# EAGLE design untitled (EAGLE 8.4.0)
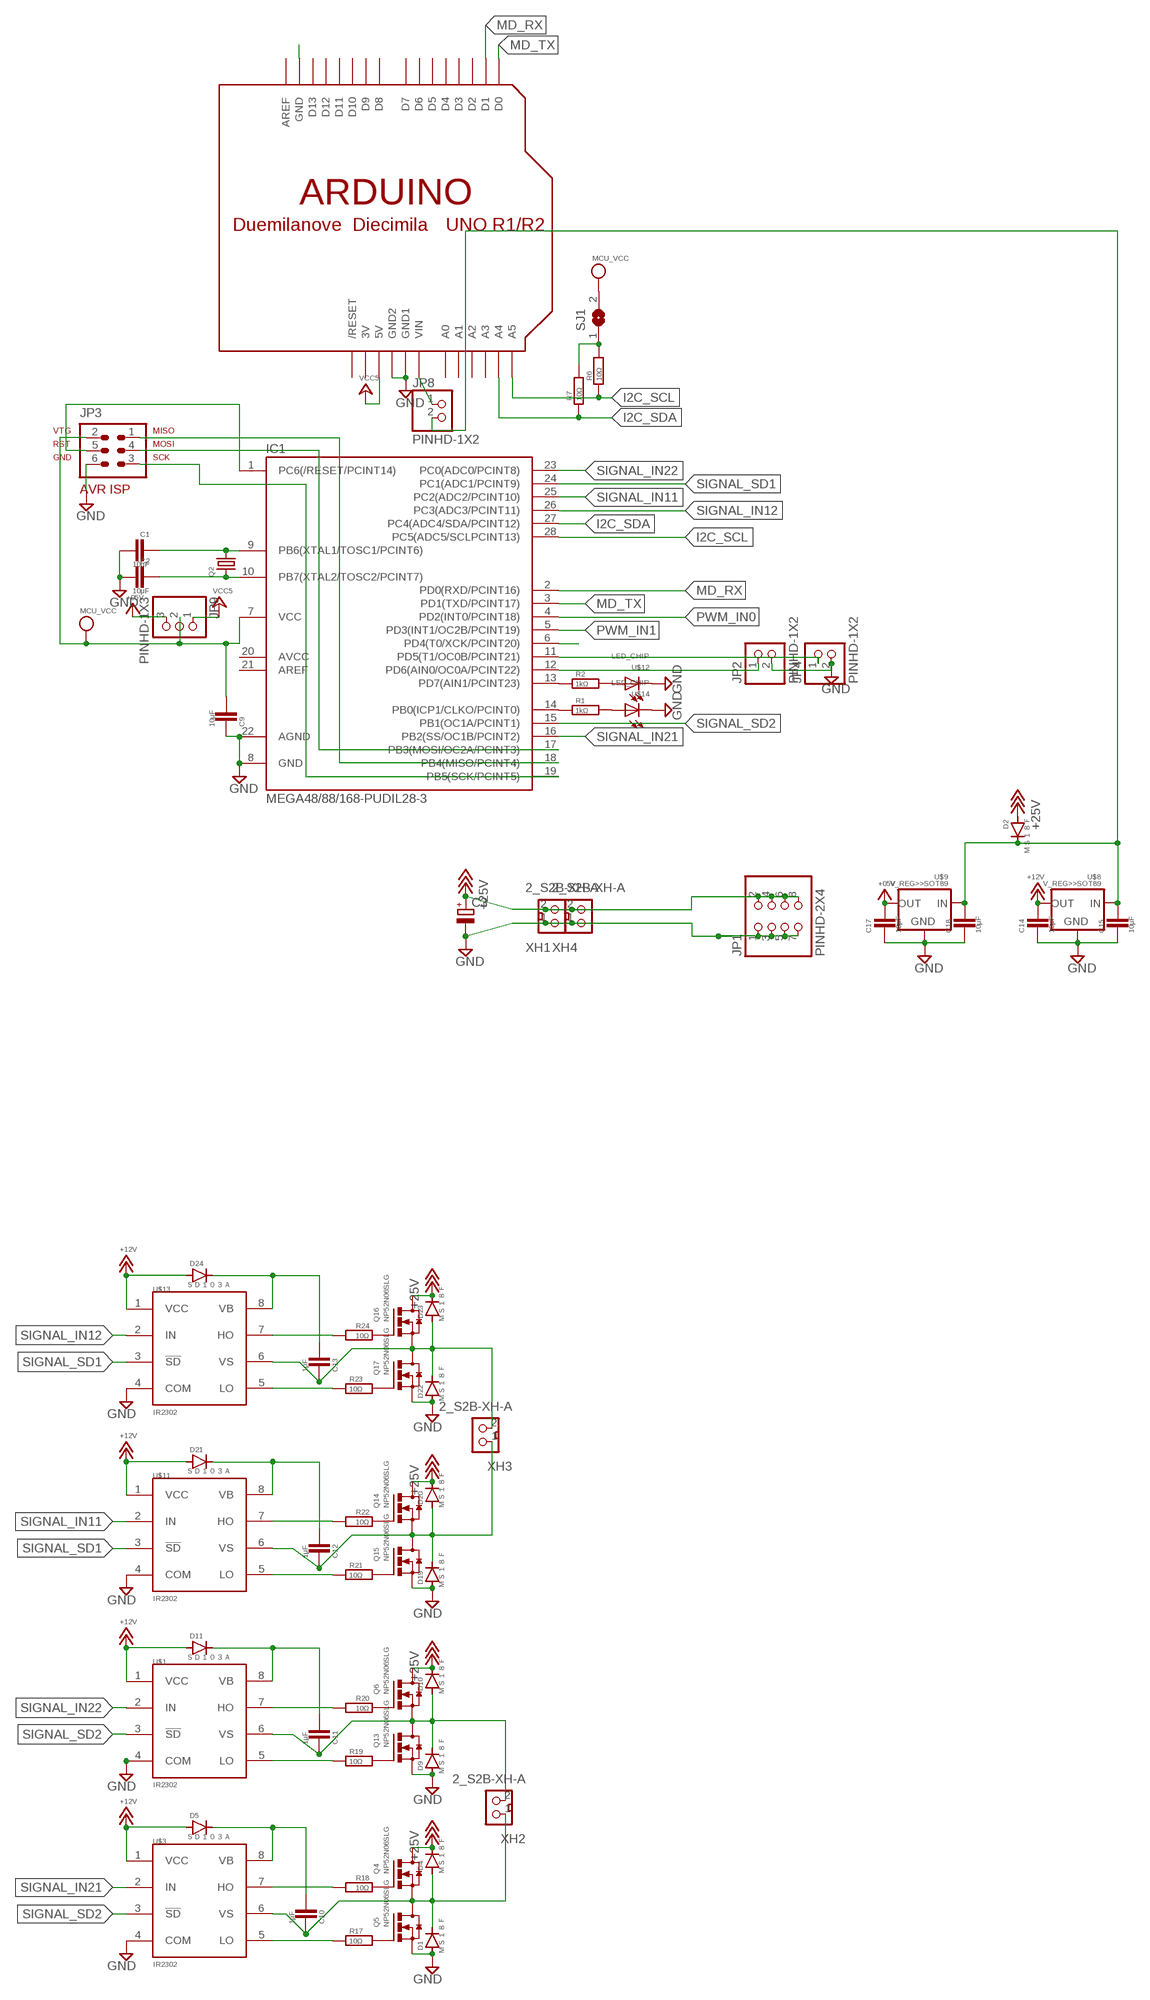
[diagram p0: schematic, sheet 1]

## Parts
C1  10μF  CAPACITOR>>2012  [2012]
C2  10μF  CAPACITOR>>2012  [2012]
C3  CPOL-EUUD-6,3X8,8  [UD-6,3X5,8_NICHICON]
C9  10μF  CAPACITOR>>2012  [2012]
C10  1μF  CAPACITOR>>2012  [2012]
C11  1μF  CAPACITOR>>2012  [2012]
C12  1μF  CAPACITOR>>2012  [2012]
C13  1μF  CAPACITOR>>2012  [2012]
C14  10μF  CAPACITOR>>2012  [2012]
C15  10μF  CAPACITOR>>2012  [2012]
C17  10μF  CAPACITOR>>2012  [2012]
C18  10μF  CAPACITOR>>2012  [2012]
D1  ＭＳ１８Ｆ  DIODE>>MS18F  [MS18F]
D2  ＭＳ１８Ｆ  DIODE>>MS18F  [MS18F]
D4  ＭＳ１８Ｆ  DIODE>>MS18F  [MS18F]
D5  ＳＤ１０３Ａ  DIODE>>SOD123  [SOD123]
D9  ＭＳ１８Ｆ  DIODE>>MS18F  [MS18F]
D10  ＭＳ１８Ｆ  DIODE>>MS18F  [MS18F]
D11  ＳＤ１０３Ａ  DIODE>>SOD123  [SOD123]
D19  ＭＳ１８Ｆ  DIODE>>MS18F  [MS18F]
D20  ＭＳ１８Ｆ  DIODE>>MS18F  [MS18F]
D21  ＳＤ１０３Ａ  DIODE>>SOD123  [SOD123]
D22  ＭＳ１８Ｆ  DIODE>>MS18F  [MS18F]
D23  ＭＳ１８Ｆ  DIODE>>MS18F  [MS18F]
D24  ＳＤ１０３Ａ  DIODE>>SOD123  [SOD123]
IC1  MEGA48/88/168-PUDIL28-3  [DIL28-3]
JP1  PINHD-2X4  [2X04]
JP2  PINHD-1X2  [1X02]
JP3  AVR-ISP-6  [AVR-ISP-6]
JP4  PINHD-1X2  [1X02]
JP8  PINHD-1X2  [1X02]
JP9  PINHD-1X3  [1X03]
Q2  CRYSTALHC49S  [HC49/S]
Q4  NP52N06SLG  MOSFET_N>>TO252  [TO252]
Q5  NP52N06SLG  MOSFET_N>>TO252  [TO252]
Q6  NP52N06SLG  MOSFET_N>>TO252  [TO252]
Q13  NP52N06SLG  MOSFET_N>>TO252  [TO252]
Q14  NP52N06SLG  MOSFET_N>>TO252  [TO252]
Q15  NP52N06SLG  MOSFET_N>>TO252  [TO252]
Q16  NP52N06SLG  MOSFET_N>>TO252  [TO252]
Q17  NP52N06SLG  MOSFET_N>>TO252  [TO252]
R1  1kΩ  REGISTER>>2012  [2012]
R2  1kΩ  REGISTER>>2012  [2012]
R6  10Ω  REGISTER>>2012  [2012]
R7  10Ω  REGISTER>>2012  [2012]
R17  10Ω  REGISTER>>2012  [2012]
R18  10Ω  REGISTER>>2012  [2012]
R19  10Ω  REGISTER>>2012  [2012]
R20  10Ω  REGISTER>>2012  [2012]
R21  10Ω  REGISTER>>2012  [2012]
R22  10Ω  REGISTER>>2012  [2012]
R23  10Ω  REGISTER>>2012  [2012]
R24  10Ω  REGISTER>>2012  [2012]
SJ1  SJ  [SJ]
U$1  IR2302  IR2302IR2302  [DIL08]
U$2  ARDUINO-NOHOLE  [ARDUINO-NOHOLE]
U$3  IR2302  IR2302IR2302  [DIL08]
U$8  V_REG>>SOT89  [SOT89]
U$9  V_REG>>SOT89  [SOT89]
U$11  IR2302  IR2302IR2302  [DIL08]
U$12  LED_CHIP  [2012]
U$13  IR2302  IR2302IR2302  [DIL08]
U$14  LED_CHIP  [2012]
XH1  2_S2B-XH-A  [S2B-XH-A]
XH2  2_S2B-XH-A  [S2B-XH-A]
XH3  2_S2B-XH-A  [S2B-XH-A]
XH4  2_S2B-XH-A  [S2B-XH-A]

## Nets
+5V: C17.1 JP9.3 U$9.1(OUT) ; supply symbol labelled +05V
+12V: C14.1 D5.A D11.A D21.A D24.A U$1.1(VCC) U$3.1(VCC) U$8.1(OUT) U$11.1(VCC) U$13.1(VCC)
+18V: C3.+ D2.P$1(A) D4.P$2(C) D10.P$2(C) D20.P$2(C) D23.P$2(C) JP1.2 JP1.4 JP1.6 JP1.8 Q4.3(D) Q6.3(D) Q14.3(D) Q16.3(D) XH1.2 XH4.2 ; supply symbol labelled +25V
GND: C1.1 C2.1 C3.- C9.2 C14.2 C15.2 C17.2 C18.2 D1.P$1(A) D9.P$1(A) D19.P$1(A) D22.P$1(A) IC1.8(GND) IC1.22(AGND) JP1.1 JP1.3 JP1.5 JP1.7 JP2.2 JP3.6 JP4.2 Q5.2(S) Q13.2(S) Q15.2(S) Q17.2(S) U$1.4(COM) U$2.GND1 U$2.GND2 U$3.4(COM) U$8.2(GND) U$8.2.1(GND) U$9.2(GND) U$9.2.1(GND) U$11.4(COM) U$12.P$2(C) U$13.4(COM) U$14.P$2(C) XH1.1 XH4.1
I2C_SCL: IC1.28(PC5(ADC5/SCLPCINT13)) R6.1 U$2.A5
I2C_SDA: IC1.27(PC4(ADC4/SDA/PCINT12)) R7.1 U$2.A4
MD_RX: IC1.2(PD0(RXD/PCINT16)) U$2.D1
MD_TX: IC1.3(PD1(TXD/PCINT17)) U$2.D0
N$1: C15.1 C18.1 D2.P$2(C) JP8.2 U$8.3(IN) U$9.3(IN)
N$2: JP8.1 U$2.VIN
N$3: C13.2 D22.P$2(C) D23.P$1(A) Q16.2(S) Q17.3(D) U$13.6(VS) XH3.2
N$4: IC1.14(PB0(ICP1/CLKO/PCINT0)) R1.1
N$5: IC1.1(PC6(/RESET/PCINT14)) JP3.5
N$6: IC1.12(PD6(AIN0/OC0A/PCINT22)) JP2.1
N$7: C1.2 IC1.9(PB6(XTAL1/TOSC1/PCINT6)) Q2.2
N$8: C2.2 IC1.10(PB7(XTAL2/TOSC2/PCINT7)) Q2.1
N$9: IC1.11(PD5(T1/OC0B/PCINT21)) JP4.1
N$10: IC1.13(PD7(AIN1/PCINT23)) R2.1
N$11: IC1.19(PB5(SCK/PCINT5)) JP3.3
N$12: C11.2 D9.P$2(C) D10.P$1(A) Q6.2(S) Q13.3(D) U$1.6(VS) XH2.2
N$14: IC1.6(PD4(T0/XCK/PCINT20))
N$15: R1.2 U$14.P$1(A)
N$16: R2.2 U$12.P$1(A)
N$17: C10.2 D1.P$2(C) D4.P$1(A) Q4.2(S) Q5.3(D) U$3.6(VS) XH2.1
N$18: Q5.1(G) R17.2
N$19: R17.1 U$3.5(LO)
N$20: R6.2 R7.2 SJ1.1
N$21: IC1.17(PB3(MOSI/OC2A/PCINT3)) JP3.4
N$22: IC1.18(PB4(MISO/PCINT4)) JP3.1
N$23: R18.2 U$3.7(HO)
N$24: C10.1 D5.C U$3.8(VB)
N$25: Q4.1(G) R18.1
N$27: U$2.GND
N$32: Q13.1(G) R19.2
N$34: R19.1 U$1.5(LO)
N$42: R20.2 U$1.7(HO)
N$45: C11.1 D11.C U$1.8(VB)
N$46: Q6.1(G) R20.1
N$48: C12.2 D19.P$2(C) D20.P$1(A) Q14.2(S) Q15.3(D) U$11.6(VS) XH3.1
N$50: Q15.1(G) R21.2
N$51: R21.1 U$11.5(LO)
N$52: R22.2 U$11.7(HO)
N$53: C12.1 D21.C U$11.8(VB)
N$54: Q14.1(G) R22.1
N$56: Q17.1(G) R23.2
N$57: R23.1 U$13.5(LO)
N$58: R24.2 U$13.7(HO)
N$59: C13.1 D24.C U$13.8(VB)
N$60: Q16.1(G) R24.1
PWM_IN0: IC1.4(PD2(INT0/PCINT18))
PWM_IN1: IC1.5(PD3(INT1/OC2B/PCINT19))
SIGNAL_IN11: IC1.25(PC2(ADC2/PCINT10)) U$11.2(IN)
SIGNAL_IN12: IC1.26(PC3(ADC3/PCINT11)) U$13.2(IN)
SIGNAL_IN21: IC1.16(PB2(SS/OC1B/PCINT2)) U$3.2(IN)
SIGNAL_IN22: IC1.23(PC0(ADC0/PCINT8)) U$1.2(IN)
SIGNAL_SD1: IC1.24(PC1(ADC1/PCINT9)) U$11.3(!SD) U$13.3(!SD)
SIGNAL_SD2: IC1.15(PB1(OC1A/PCINT1)) U$1.3(!SD) U$3.3(!SD)
VCC: C9.1 IC1.7(VCC) JP3.2 JP9.2 SJ1.2 ; supply symbol labelled MCU_VCC
VCC5: JP9.1 U$2.5V
Unconnected: IC1.20(AVCC) IC1.21(AREF) U$2.A0 U$2.A1 U$2.A2 U$2.A3 U$2.AREF U$2.D2 U$2.D3 U$2.D4 U$2.D5 U$2.D6 U$2.D7 U$2.D8 U$2.D9 U$2.D10 U$2.D11 U$2.D12 U$2.D13 U$2.RESET(/RESET)

## Power pins joined to a net without a drawn wire
3V: U$2.3V

## Library data of the parts
C1 C2 C9-C15 C17 C18 = !SMD:CAPACITOR>>
C3 = !rcl:CPOL-EU: POLARIZED CAPACITOR, European symbol
D1 D2 D4 D5 D9-D11 D19-D24 = !diode:DIODE>>: DIODE
IC1 = !avr:MEGA48/88/168-PU
JP1 = !pinhead(ﾋﾟﾝﾍｯﾀﾞ):PINHD-2X4: PIN HEADER
JP2 JP4 JP8 = !pinhead(ﾋﾟﾝﾍｯﾀﾞ):PINHD-1X2: PIN HEADER
JP3 = !avr:AVR-ISP-6: AVR ISP-6 Serial Programming Header
JP9 = !pinhead(ﾋﾟﾝﾍｯﾀﾞ):PINHD-1X3: PIN HEADER
Q2 = !crystal(水晶):CRYSTAL: CRYSTAL; OC_FARNELL: 1667008; OC_NEWARK: unknown
Q4-Q6 Q13-Q17 = !FET_transister_v-reg:MOSFET_N>>
R1 R2 R6 R7 R17-R24 = !SMD:REGISTER>>
SJ1 = jumper:SJ: SMD solder JUMPER
U$1 U$3 U$11 U$13 = !irs(GateDriver):IR2302
U$2 = adafruit:ARDUINO: Arduino Diecimila/Duemilanove Make a shield with ease, this package has all the named pins as well as the two mounting drill holes and an outline of the USB and DC power connector. The outline is on the DIMENSION layer, so if your board house uses it they will cut the outline to match. http://www.ladyada.net/library/pcb/eaglelibrary.html
U$8 U$9 = !FET_transister_v-reg:V_REG>>
U$12 U$14 = !led:LED_CHIP
XH1-XH4 = !con-xh:2_: Wire-to-Board 2.5mm pitch top mount connector Source: http://www.jst-mfg.com/product/pdf/jpn/XH.pdf http://www.jst-mfg.com/product/detail.php?series=277

## Board
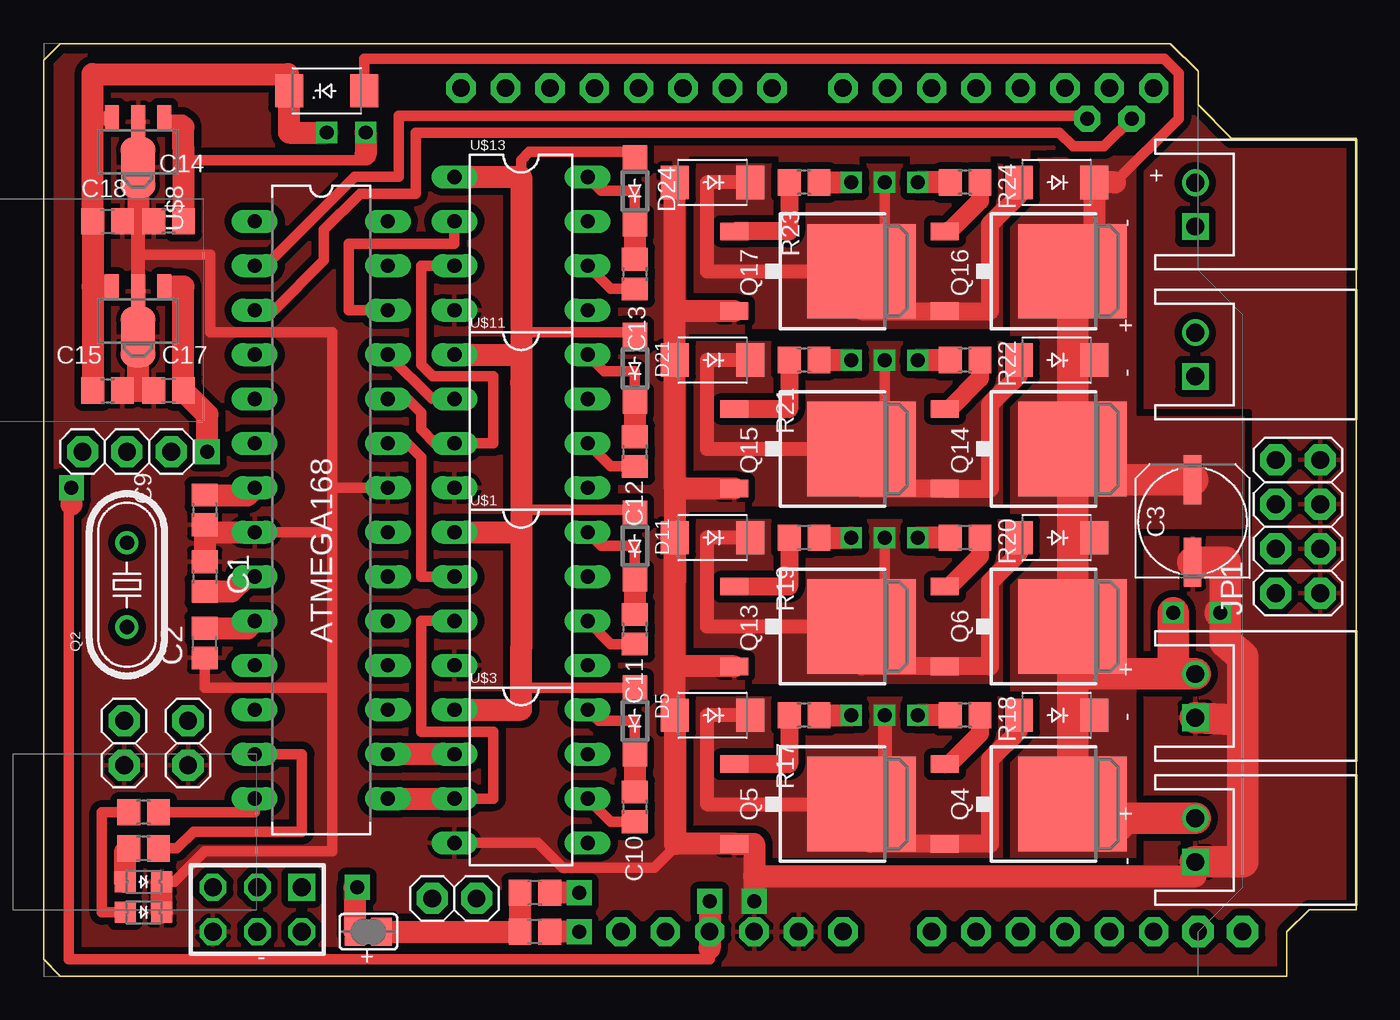
[diagram p1: board, top side]
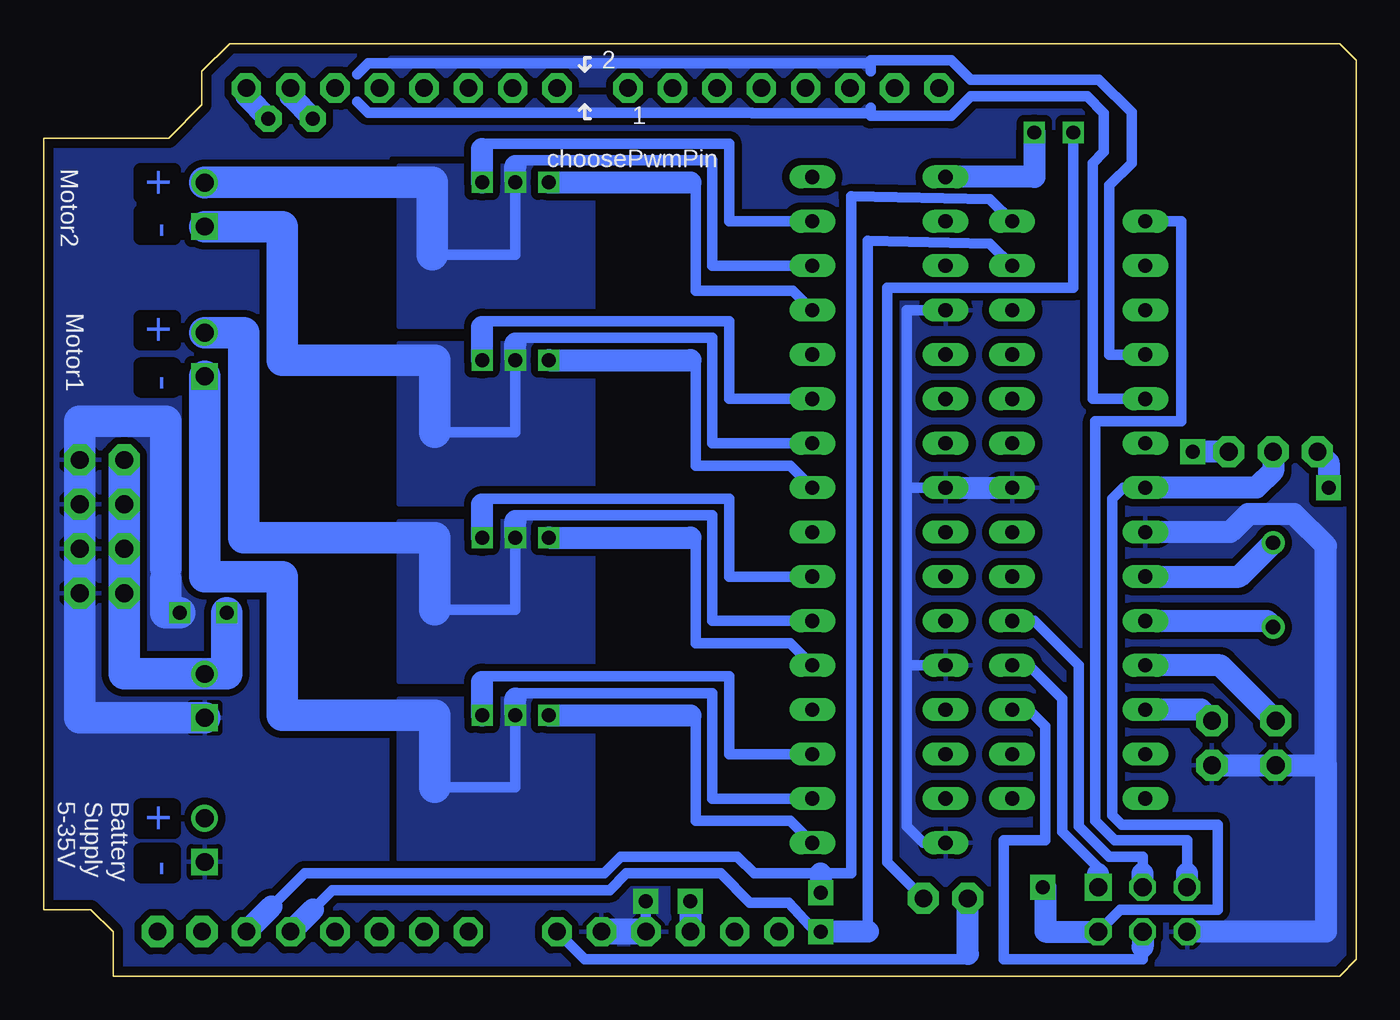
[diagram p2: board, bottom side, seen from below]

Size 75.09 x 53.34 mm. Coordinates in mm from the lower left corner, seen from the top.
Outline: 0.95,53.34 0,52.39 0,0.95 0.95,0 71.12,0 71.12,2.54 72.39,3.81 75.09,3.81 75.09,47.94 67.94,47.94 66.04,49.85 66.04,51.75 64.45,53.34 0.95,53.34
Copper layers (1*16): Top 0.035mm / dielectric 1.5mm / Bottom 0.035mm
Design rules "yumeko *": minimum track width 6mil, minimum drill 0.35mm, track to track 8mil, track to pad 8mil, pad to pad 8mil, via to via 8mil, smd to smd 8mil, copper to edge 20mil, drill to drill 8mil, minimum pad ring 10mil, minimum via ring 8mil, stop-mask expansion 4mil, vias tented up to drill 0mil, thermal gap 10mil

### Footprints (pad centres in the part's own frame; a part is rotated, then mirrored left to right if it is on the bottom)
2012 = smd 1.3 x 1.5: 1 -0.85,0; 2 0.85,0
UD-6,3X5,8_NICHICON = smd 2.8 x 1: + 2.35,0; - -2.35,0
MS18F = smd 1.6 x 1.9: P$1 -2.15,0; P$2 2.15,0
SOD123 = smd 1.4 x 1.4: A 1.9,0; C -1.9,0
DIL28-3 = drill 0.813 long: 1 -16.51,-3.81; 2 -13.97,-3.81; 3 -11.43,-3.81; 4 -8.89,-3.81; 5 -6.35,-3.81; 6 -3.81,-3.81; 7 -1.27,-3.81; 8 1.27,-3.81; 9 3.81,-3.81; 10 6.35,-3.81; 11 8.89,-3.81; 12 11.43,-3.81; 13 13.97,-3.81; 14 16.51,-3.81; 15 16.51,3.81; 16 13.97,3.81; 17 11.43,3.81; 18 8.89,3.81; 19 6.35,3.81; 20 3.81,3.81; 21 1.27,3.81; 22 -1.27,3.81; 23 -3.81,3.81; 24 -6.35,3.81; 25 -8.89,3.81; 26 -11.43,3.81; 27 -13.97,3.81; 28 -16.51,3.81
2X04 = drill 1.016 pad 1.778 octagon: 1 -3.81,-1.27; 2 -3.81,1.27; 3 -1.27,-1.27; 4 -1.27,1.27; 5 1.27,-1.27; 6 1.27,1.27; 7 3.81,-1.27; 8 3.81,1.27
1X02 = drill 1.016 pad 1.778 octagon: 1 -1.27,0; 2 1.27,0
AVR-ISP-6 = drill 1.016 square: 1 -2.54,-1.27 | drill 1.016 octagon: 2 -2.54,1.27; 3 0,-1.27; 4 0,1.27; 5 2.54,-1.27; 6 2.54,1.27
1X03 = drill 1.016 pad 1.778 octagon: 1 -2.54,0; 2 0,0; 3 2.54,0
HC49/S = drill 0.813: 1 -2.413,0; 2 2.413,0
TO252 = smd 1 x 1.6: 1 -2.28,-4.8; 2 2.28,-4.8 | smd 5.4 x 6.2: 3 0,2.5
SJ = smd 1.168 x 1.6: 1 -0.762,0; 2 0.762,0
DIL08 = drill 0.813 long: 1 -3.81,-3.81; 2 -1.27,-3.81; 3 1.27,-3.81; 4 3.81,-3.81; 5 3.81,3.81; 6 1.27,3.81; 7 -1.27,3.81; 8 -3.81,3.81
ARDUINO-NOHOLE = drill 1 pad 1.676 octagon: 3V 35.56,2.54; 5V 38.1,2.54; A0 50.8,2.54; A1 53.34,2.54; A2 55.88,2.54; A3 58.42,2.54; A4 60.96,2.54; A5 63.5,2.54; AREF 23.876,50.8; D0 63.5,50.8; D1 60.96,50.8; D2 58.42,50.8; D3 55.88,50.8; D4 53.34,50.8; D5 50.8,50.8; D6 48.26,50.8; D7 45.72,50.8; D8 41.656,50.8; D9 39.116,50.8; D10 36.576,50.8; D11 34.036,50.8; D12 31.496,50.8; D13 28.956,50.8; GND 26.416,50.8; GND1 43.18,2.54; GND2 40.64,2.54; RESET 33.02,2.54; VIN 45.72,2.54
SOT89 = smd 0.8 x 1.4: 1 -1.499,-1.981; 3 1.499,-1.981 | smd 0.8 x 1.9: 2 0,-1.727 | smd 2 x 3.5: 2.1 0,0.889
2012' = smd 1.2 x 1.2: P$1 -1.05,0; P$2 1.05,0
S2B-XH-A = drill 1.016 square: 1 1.25,0 | drill 1.016: 2 -1.25,0

### Placement (x,y rotation side)
C1  9.21,22.86 270 top
C2  9.21,19.05 90 top
C3  65.72,26.04 90 top
C9  9.21,26.67 270 top
C10  33.81,9.68 270 top
C11  33.81,19.84 270 top
C12  33.81,30 270 top
C13  33.81,40.16 270 top
C14  7.14,43.18 180 top
C15  3.65,33.5 0 top
C17  7.14,33.5 180 top
C18  3.65,43.18 0 top
D1  38.26,14.92 0 top
D2  16.19,50.64 180 top
D4  57.94,14.92 0 top
D5  33.81,14.61 90 top
D9  38.26,25.08 0 top
D10  57.94,25.08 0 top
D11  33.81,24.61 90 top
D19  38.26,35.24 0 top
D20  57.94,35.24 0 top
D21  33.81,34.77 90 top
D22  38.26,45.4 0 top
D23  57.94,45.4 0 top
D24  33.81,44.93 90 top
IC1  15.88,26.67 270 top
JP1  71.75,25.72 90 top
JP2  8.26,13.34 270 top
JP3  12.22,3.81 180 top
JP4  4.6,13.34 270 top
JP8  23.5,4.45 0 top
JP9  4.76,30 0 top
Q2  4.76,22.38 90 top
Q4  56.36,9.84 270 top
Q5  44.29,9.84 270 top
Q6  56.36,20 270 top
Q13  44.29,20 270 top
Q14  56.36,30.16 270 top
Q15  44.29,30.16 270 top
Q16  56.36,40.32 270 top
Q17  44.29,40.32 270 top
R1  5.71,9.37 180 top
R2  5.71,7.3 180 top
R6  28.1,4.76 180 top
R7  28.1,2.54 180 top
R17  43.5,14.92 180 top
R18  52.7,14.92 180 top
R19  43.5,25.08 180 top
R20  52.7,25.08 180 top
R21  43.5,35.24 180 top
R22  52.7,35.24 180 top
R23  43.5,45.4 180 top
R24  52.7,45.4 180 top
SJ1  18.57,2.54 180 top
U$1  27.3,21.59 270 top
U$2  0,0 0 top
U$3  27.3,11.43 270 top
U$8  5.4,47.15 180 top
U$9  5.4,37.47 180 top
U$11  27.3,31.75 270 top
U$12  LED_CHIP  [2012']  5.71,5.4 0 top
U$13  27.3,41.91 270 top
U$14  LED_CHIP  [2012']  5.71,3.65 0 top
XH1  65.88,16.03 270 top
XH2  65.88,35.56 270 top
XH3  65.88,44.13 270 top
XH4  65.88,7.78 270 top

### Tracks (layer width: path | path; a pad name or v marks a point on that pad's centre or on a via)
+5V  (via drill 0.8 pad 1.42)
  Top 0.813: 7.38,39.45 U$9.1
  Top 1.27: 7.38,39.45 7.99,39.45 C17.1 9.37,32.12 v9.37,30
  Bottom 1.27: JP9.3 v9.37,30
+12V  (via drill 0.8)
  Top 0.61: 27.3,33.97 27.3,26.67 | 27.3,18.73 27.3,16.51 | D24.A 33.81,47.15 27.78,47.15 27.3,46.67 27.3,45.72 27.3,36.83 | 27.3,35.56 27.3,36.83 | D5.A 27.3,16.51 | D11.A 33.81,26.67 27.3,26.67 | D21.A 33.81,36.83 27.3,36.83 | 27.3,26.67 27.3,25.4 | U$3.1 26.67,15.24 27.3,15.88 27.3,16.51 | 7.99,47.47 7.99,47.31 | 18.41,46.99 18.41,46.67 7.99,46.67
  Top 0.813: U$8.1 6.9,48.9 7.94,48.9 7.99,48.84 7.99,48.58
  Top 1.27: 7.99,48.58 7.99,47.31 7.99,46.67 C14.1 | U$1.1 27.3,25.4 | 27.3,25.4 27.3,18.73 27.3,15.24 U$3.1 | U$11.1 27.3,35.56 | 27.3,35.56 27.3,33.97 27.3,25.4 | U$13.1 27.3,45.72 27.3,35.56 | v18.41,48.26 18.41,46.99
  Bottom 1.27: U$13.1 18.41,45.72 v18.41,48.26
+18V  (via drill 0.8)
  Top 0.61: Q6.3 58.9,20 | Q4.3 58.9,9.84 | Q14.3 58.9,30.16 | Q16.3 57.63,40.32 | 18.51,50.64 D2.P$1 18.34,52.48 64.09,52.48 64.93,51.64 64.93,49.05 61.28,45.4
  Top 1.016: Q4.3 59.67,9.03 61.44,9.03
  Top 1.27: 60.13,40.32 Q16.3 59.49,40.62 | 60.17,40.32 60.13,40.32 | 59.53,9.84 58.86,9.91 58.86,14.92 D4.P$2 | 60.13,40.32 D23.P$2 61.28,45.4 | D20.P$2 58.86,35.24 | 58.86,25.08 D10.P$2
  Top 1.8: Q4.3 58.86,9.91 58.86,17.28 | 58.86,17.28 Q6.3 58.86,25.08 58.86,28.39 | 58.86,28.39 Q14.3 58.86,35.24 Q16.3 | XH4.2 61.44,9.03 61.44,8.57 | 58.86,17.28 64.61,17.28 | C3.+ 58.86,28.39 | XH1.2 64.61,17.28 | 64.61,17.28 v64.61,20.8
  Bottom 1.8: JP1.8 JP1.6 JP1.4 JP1.2 70.48,17.28 XH1.2 64.61,17.28 v64.61,20.8
  pour Top (isolate 0.406, rank 2, no thermals): 62.39,6.67 62.39,25.72 68.58,25.72 68.58,31.91 62.39,31.91 62.39,46.83 55.4,46.67 55.4,6.67
GND  (via drill 0.8, 0.8 pad 1.42)
  Top 0.61: 5.08,45.48 5.4,45.48 U$8.2.1 U$8.2 | U$3.4 28.26,7.62 29.69,6.19 34.92,6.19 36.2,7.46 36.11,7.46 36.11,7.56 | U$11.4 23.18,27.94 | 5.4,41.27 9.53,41.27 9.53,36.83 16.51,36.83 16.51,27.94 | 16.51,25.4 IC1.8 | 16.51,16.51 16.51,25.4 | 16.51,25.4 16.51,27.94 | 16.51,27.94 IC1.22 | 16.51,16.51 9.21,16.51 C2.1 | U$12.P$2 7.46,5.4 9.21,7.14 16.51,7.14 16.51,16.51
  Top 0.813: 5.4,37.26 U$9.2 5.4,41.27 5.4,43.18
  Top 1.27: 5.4,33.5 C17.2 | C15.2 5.4,33.5 | 5.4,33.5 U$9.2.1 5.4,37.26 | 36.11,38.04 D19.P$1 36.11,27.88 | 36.11,38.04 D22.P$1 | 36.11,27.88 D9.P$1 | D9.P$1 36.11,22.63 | Q17.2 36.11,38.04 | Q15.2 36.11,27.88 | Q13.2 36.11,17.72 | 36.11,17.72 D9.P$1 | 36.11,17.72 D1.P$1 36.11,7.56 Q5.2 40.64,7.56 40.64,5.71 | XH4.1 65.88,5.71 40.64,5.71 | 5.4,43.18 C14.2 | U$8.2.1 5.4,43.18 | 5.4,43.18 C18.2 | 9.21,25.4 IC1.8 | C9.2 9.21,25.4 | 9.21,25.4 C1.1 | 40.64,5.71 v40.64,4.29 | U$14.P$2 U$12.P$2
  Top 1.8: 68.58,14.62 XH1.1 | 68.58,14.62 68.58,18.26 67.59,19.13 67.59,20.8 | 68.58,14.62 68.58,6.53 XH4.1 | C3.- 67.59,23.68 67.59,20.8 | v67.31,20.8 67.59,20.8
  Bottom 0.61: 25.72,27.94 U$11.4 | 25.72,17.78 25.72,27.94 | U$13.4 25.72,38.1 25.72,27.94 | U$1.4 25.72,17.78 | 25.72,17.78 25.72,8.57 24.77,7.62 U$3.4 | U$2.GND2 v40.64,4.29
  Bottom 1.27: JP2.2 JP4.2 1.75,12.06 | 68.1,22.7 68.1,23.34 | U$11.4 IC1.22 | IC1.8 7.22,25.4 6.19,26.43 3.57,26.43 1.75,24.61 1.75,12.06 | JP3.6 1.75,2.54 1.75,12.06
  Bottom 1.5: U$2.GND2 U$2.GND1
  Bottom 1.8: XH1.1 73.03,14.78 JP1.1 JP1.3 JP1.5 JP1.7 73.03,31.75 70.66,31.75 68.1,31.75 68.1,23.34 | 68.1,22.7 68.1,20.8 v67.31,20.8
  pour Bottom (isolate 0.406, rank 6): 0,53.34 64.45,53.34 66.04,51.75 66.04,49.69 67.79,47.94 75.09,47.94 75.09,3.81 72.39,3.81 71.12,2.54 71.12,0 0.32,0
  pour Top (isolate 0.406, rank 6): 0,53.34 64.45,53.34 66.04,51.75 66.04,49.69 67.79,47.94 75.09,47.94 75.09,3.81 72.39,3.81 71.12,2.54 71.12,0 0.32,0
I2C_SCL  (via drill 0.8 pad 1.42)
  Top 1.27: v30.64,4.76 R6.1
  Bottom 0.61: 62.07,3.97 60.17,5.87 43.02,5.87 42.07,6.83 35.4,6.83 34.45,5.87 30.64,5.87 28.89,5.87 28.89,44.61 20.95,44.45 IC1.28
  Bottom 1.27: 30.64,5.87 v30.64,4.76 | U$2.A5 62.07,3.97
I2C_SDA  (via drill 0.8 pad 1.42)
  Top 1.27: v30.64,2.54 R7.1
  Bottom 0.61: 19.05,40.64 IC1.27 20.95,41.91 27.94,42.07 27.94,2.54 | 59.69,3.81 58.58,4.92 42.7,4.92 41.75,5.87 36.35,5.87 34.69,4.21 32.46,4.21 30.96,2.54 v30.64,2.54
  Bottom 1.27: 27.94,2.54 v30.64,2.54 | U$2.A4 59.69,3.81
MD_RX  (via drill 0.8 pad 1.5)
  Top 0.61: v59.69,49.05 59.53,49.21 20.32,49.21 20.32,45.72 17.78,45.72 12.7,40.64 IC1.2
  Bottom 1.27: U$2.D1 60.96,50.32 v59.69,49.05
MD_TX  (via drill 0.8 pad 1.5)
  Top 0.61: v62.23,49.05 60.64,47.47 58.9,47.47 58.1,48.26 21.27,48.26 21.27,44.77 18.1,44.77 16.03,42.7 16.03,40.96 13.18,38.1 IC1.3
  Bottom 1.27: U$2.D0 63.5,50.32 v62.23,49.05
N$1  (via drill 0.8)
  Top 0.813: 3.45,39.45 U$9.3 | U$8.3 3.9,49.05 2.8,49.05
  Top 1.27: 2.8,39.45 C15.1 | 2.8,39.45 3.45,39.45 | 2.8,49.05 C18.1 2.8,39.45 | 2.8,49.05 2.86,49.05 | 2.8,49.05 2.8,51.59 13.97,51.59 13.97,50.64 D2.P$2 14.04,48.26 v16.19,48.26
  Bottom 0.61: v16.19,48.26 16.19,39.37 26.83,39.37 26.83,6.51 JP8.2
N$2
  Bottom 0.61: 22.23,1.27 22.23,0.95 44.13,0.95 U$2.VIN
  Bottom 1.27: 22.23,1.27 JP8.1
N$3  (via drill 0.8)
  Top 0.61: Q17.3 48.1,40.32 v48.1,45.4 | U$13.6 32.44,39.31 C13.2
  Top 0.813: D22.P$2 37.94,45.4 37.94,40.32 Q17.3
  Top 1.016: Q16.2 46.79,38.04 Q17.3 | 51.59,38.04 Q16.2 | Q16.2 54.13,38.04 54.13,43.02 55.79,44.68 D23.P$1
  Bottom 0.61: 48.1,46.35 48.1,46.67 36.83,46.67 36.83,40.64 U$13.6 | v48.1,45.4 48.1,41.27 52.86,41.27
  Bottom 1.27: v48.1,45.4 48.1,46.35
  Bottom 1.8: XH3.2 65.88,45.4 52.86,45.4 52.86,41.27
  pour Top (isolate 0.406, rank 3, no thermals): 54.77,46.35 37.31,46.35 37.31,37.15 54.77,37.15
  pour Bottom (isolate 0.406, rank 3, no thermals): 43.66,46.35 54.77,46.35 54.77,37.15 43.66,37.15
N$4
  Top 0.61: R1.1 12.06,9.37 IC1.14
N$5
  Bottom 0.61: IC1.1 10,43.18 10,31.75 14.92,31.75 14.92,8.89 13.81,7.78 9.68,7.78 9.68,5.87
  Bottom 1.27: JP3.5 9.68,5.87
N$6
  Bottom 1.27: JP2.1 8.89,15.24 IC1.12
N$7
  Top 1.27: IC1.9 11.59,22.86 10.74,22.01 C1.2
  Bottom 1.27: Q2.2 6.7,22.86 IC1.9
N$8
  Top 1.27: C2.2 11.64,19.9 IC1.10
  Bottom 1.27: Q2.1 5.11,20.32 IC1.10
N$9
  Bottom 1.27: JP4.1 7.78,17.78 IC1.11
N$10
  Top 0.61: 14.76,12.7 IC1.13 14.76,12.7 | 14.76,12.7 14.76,8.26 8.57,8.26 7.62,7.3 R2.1
N$11
  Bottom 0.61: IC1.19 18.41,20.32 15.88,17.78 15.88,8.57 14.13,6.83 12.22,6.83 12.22,5.87
  Bottom 1.27: JP3.3 12.22,5.87
N$12  (via drill 0.8)
  Top 0.61: Q13.3 48.1,20 v48.1,25.08 | U$1.6 32.44,18.99 C11.2
  Top 0.813: D9.P$2 37.94,25.08 37.94,20 Q13.3
  Top 1.016: Q6.2 46.79,17.72 Q13.3 | Q6.2 54.13,17.72 54.13,22.54 55.79,24.2 D10.P$1 | 51.59,17.72 Q6.2
  Bottom 0.61: 48.1,26.04 48.1,26.35 36.83,26.35 36.83,20.32 U$1.6 | v48.1,25.08 48.1,20.95 52.7,20.95
  Bottom 1.27: v48.1,25.08 48.1,26.04
  Bottom 1.8: 52.7,20.95 52.7,25.08 63.66,25.08 63.66,36.81 XH2.2
  pour Bottom (isolate 0.406, rank 3, no thermals): 54.77,26.04 54.77,16.83 43.66,16.83 43.66,26.04
  pour Top (isolate 0.406, rank 3, no thermals): 37.31,26.04 37.31,16.83 54.77,16.83 54.77,26.04
N$15
  Top 0.61: U$14.P$1 3.33,3.65 3.33,9.37 R1.2
N$16
  Top 1.27: U$12.P$1 4.67,7.1 R2.2
N$17  (via drill 0.8)
  Top 0.61: 48.74,10.79 46.83,10.79 | U$3.6 32.44,8.83 C10.2
  Top 0.813: Q5.3 37.94,9.84 37.94,14.92 D1.P$2 | v48.1,14.92 48.1,12.06
  Top 1.016: Q4.2 47.31,7.56 47.31,9.84 48.42,9.84 | Q4.2 54.13,7.56 54.13,12.38 55.79,14.04 D4.P$1 | 51.59,7.56 Q4.2
  Top 1.27: Q5.3 47.31,9.84
  Top 1.8: 48.42,9.84 Q5.3
  Bottom 0.61: 48.1,15.88 48.1,16.19 36.83,16.19 36.83,10.16 U$3.6 | v48.1,14.92 48.1,10.79 52.7,10.79
  Bottom 1.27: v48.1,14.92 48.1,15.88
  Bottom 1.8: XH2.1 65.88,22.86 61.44,22.86 61.44,14.92 52.7,14.92 52.7,10.79
  pour Top (isolate 0.406, rank 3, no thermals): 54.77,15.88 37.31,15.88 37.31,6.67 54.77,6.67
  pour Bottom (isolate 0.406, rank 3, no thermals): 43.66,15.88 54.77,15.88 54.77,6.67 43.66,6.67
N$18
  Top 1.016: R17.2 42.65,12.12 Q5.1
N$19  (via drill 0.8)
  Top 1.27: R17.1 v46.2,14.92
  Bottom 0.61: 38.1,14.92 37.78,14.92 37.78,8.89 32.38,8.89 U$3.5
  Bottom 1.27: v46.2,14.92 38.1,14.92
N$20
  Top 1.27: R6.2 R7.2 SJ1.1
N$21
  Bottom 0.61: IC1.17 18.73,15.24 17.78,14.29 17.78,7.78 20.16,7.78 20.16,0.95 12.22,0.95 12.22,1.67
  Bottom 1.27: JP3.4 12.22,1.67
N$22
  Bottom 0.61: IC1.18 18.73,17.78 16.83,15.88 16.83,8.26 14.76,6.19 14.76,5.84
  Bottom 1.27: JP3.1 14.76,5.84
N$23  (via drill 0.8)
  Top 1.27: R18.2 v50.01,14.92
  Bottom 0.61: 50.01,16.83 50.01,17.14 35.88,17.14 35.88,12.7 U$3.7
  Bottom 1.27: v50.01,14.92 50.01,16.83
N$24
  Top 0.61: 33.81,11.11 C10.1 | U$3.8 31.75,14.61 33.81,14.61 D5.C
  Top 1.27: D5.C 33.81,11.11
N$25
  Top 1.016: 51.59,12.12 Q4.1 51.81,12.12 53.55,13.87 R18.1
N$26  (via drill 1 pad 1.8)
  other vias: 66.04,2.54
N$28  (via drill 1 pad 1.8)
  other vias: 68.58,2.54
N$32
  Top 1.016: R19.2 42.65,22.28 Q13.1
N$34  (via drill 0.8)
  Top 1.27: R19.1 v46.2,25.08
  Bottom 0.61: 38.1,25.08 37.78,25.08 37.78,19.05 32.38,19.05 U$1.5
  Bottom 1.27: v46.2,25.08 38.1,25.08
N$42  (via drill 0.8)
  Top 1.27: R20.2 v50.01,25.08
  Bottom 0.61: 50.01,26.99 50.01,27.3 35.88,27.3 35.88,22.86 U$1.7
  Bottom 1.27: v50.01,25.08 50.01,26.99
N$45
  Top 0.61: U$1.8 31.91,24.61 33.81,24.61 D11.C
  Top 1.27: D11.C C11.1
N$46
  Top 1.016: R20.1 53.55,24.03 51.81,22.28 Q6.1
N$48  (via drill 0.8)
  Top 0.61: Q15.3 48.1,30.16 v48.1,35.24 | U$11.6 32.44,29.15 C12.2
  Top 0.813: D19.P$2 37.94,35.24 37.94,30.16 Q15.3
  Top 1.016: 51.59,27.88 Q14.2 | Q14.2 46.79,27.88 Q15.3 | Q14.2 54.13,27.88 54.13,32.7 55.79,34.36 D20.P$1
  Bottom 0.61: 48.1,36.2 48.1,36.51 36.83,36.51 36.83,30.48 U$11.6 | v48.1,35.24 48.1,31.11 52.7,31.11
  Bottom 1.27: v48.1,35.24 48.1,36.2
  Bottom 1.8: XH3.1 61.44,42.88 61.44,35.24 52.7,35.24 52.7,31.11
  pour Top (isolate 0.406, rank 3, no thermals): 37.31,36.2 37.31,26.99 54.77,26.99 54.77,36.2
  pour Bottom (isolate 0.406, rank 3, no thermals): 54.77,36.2 54.77,26.99 43.66,26.99 43.66,36.2
N$50
  Top 1.016: R21.2 42.65,32.44 Q15.1
N$51  (via drill 0.8)
  Top 1.27: v46.2,35.24 R21.1
  Bottom 0.61: 38.1,35.24 37.78,35.24 37.78,29.21 32.38,29.21 U$11.5
  Bottom 1.27: v46.2,35.24 38.1,35.24
N$52  (via drill 0.8)
  Top 1.27: R22.2 v50.01,35.24
  Bottom 0.61: 50.01,37.15 50.01,37.47 35.88,37.47 35.88,33.02 U$11.7
  Bottom 1.27: v50.01,35.24 50.01,37.15
N$53
  Top 0.61: U$11.8 32.07,34.61 33.81,34.61 D21.C
  Top 1.27: D21.C C12.1
N$54
  Top 1.016: R22.1 53.55,34.19 51.81,32.44 Q14.1
N$56
  Top 1.016: R23.2 42.65,42.6 Q17.1
N$57  (via drill 0.8)
  Top 1.27: R23.1 v46.2,45.4
  Bottom 0.61: 38.1,45.4 37.78,45.4 37.78,39.21 32.23,39.21 U$13.5
  Bottom 1.27: v46.2,45.4 38.1,45.4
N$58  (via drill 0.8)
  Top 1.27: R24.2 v50.01,45.4
  Bottom 0.61: 50.01,47.31 50.01,47.62 35.88,47.62 35.88,43.18 U$13.7
  Bottom 1.27: v50.01,45.4 50.01,47.31
N$59
  Top 0.61: U$13.8 31.91,44.93 33.81,44.93 D24.C
  Top 1.27: D24.C C13.1
N$60
  Top 1.016: R24.1 53.55,44.35 51.81,42.6 Q16.1
PWM_IN0
  Bottom 0.61: IC1.4 14.13,35.56 14.13,45.24 12.86,46.51 12.86,49.41 14.73,51.28 22.07,51.28 23.18,52.39 27.78,52.39 27.78,52.23 | 27.78,51.75 27.78,52.23 | 57.15,51.59 56.52,52.23 27.78,52.23
  pour Bottom (isolate 0.406): 28.1,50.96 28.1,52.55 55.24,52.55 56.67,51.12 56.67,50.96
PWM_IN1
  Bottom 0.61: IC1.5 15.08,33.02 15.08,46.51 14.45,47.15 14.45,49.37 15.4,50.32 22.07,50.32 23.18,49.21 27.78,49.21 27.78,49.37 | 27.78,49.69 27.78,49.37 | 57.15,50.01 56.53,49.39 34.59,49.39 34.57,49.37 27.78,49.37
  pour Bottom (isolate 0.406, rank 2): 28.1,50.64 28.1,49.21 55.4,49.21 56.67,50.48 56.67,50.64
SIGNAL_IN11
  Top 0.61: IC1.25 22.23,33.02 U$11.2
SIGNAL_IN12
  Top 0.61: IC1.26 17.46,38.1 17.46,41.91 23.5,41.91 U$13.2
SIGNAL_IN21
  Top 1.27: U$3.2 IC1.16
SIGNAL_IN22
  Top 0.61: IC1.23 20.8,30.48 21.59,29.69 21.59,22.86 U$1.2
SIGNAL_SD1
  Top 0.61: U$13.3 21.59,40.64 21.59,34.96 22.24,34.31 25.72,34.31 25.72,30.48 U$11.3 22.38,30.48 21.59,31.27 21.59,32.23 20.8,33.02 IC1.24
SIGNAL_SD2
  Top 0.61: U$3.3 25.72,10.16 25.72,13.97 21.59,13.97 21.59,20.32 U$1.3
  Top 1.27: IC1.15 U$3.3
VCC  (via drill 0.8 pad 1.42)
  Top 1.27: C9.1 9.53,27.51 11.63,27.51 IC1.7 | SJ1.2 17.78,2.54 17.78,5.08 v17.94,5.08
  Bottom 0.61: IC1.7 12.22,27.94 13.34,27.94 13.97,27.3 13.97,9.21 13.41,8.65 7.94,8.65 7.94,3.81 13.49,3.81 JP3.2 15.56,2.54
  Bottom 0.813: 5.71,27.94 IC1.7
  Bottom 1.27: JP3.2 17.78,2.54 17.78,5.08 v17.94,5.08 | JP9.2 4.76,28.89 5.71,27.94 12.22,27.94
VCC5  (via drill 0.8 pad 1.42)
  Top 0.61: 1.59,26.99 1.43,26.99 1.43,0.96 38.1,0.96 38.1,1.59
  Top 1.27: v1.59,27.94 1.59,26.99 | v38.1,4.29 38.1,1.59
  Bottom 1.27: JP9.1 1.59,29.37 v1.59,27.94 | v38.1,4.29 U$2.5V

### Text on the board
Bottom: + | - | + | - | + | -
tPlace: .
tNames: + | - | + | - | ATMEGA168 | + | - | + | - | - | +
bNames: 2 | 1 | choosePwmPin | Motor2 | Motor1 | 2017/10 / ver.1.01 | Battery / Supply / 5-35V